# EAGLE schematic RespeakerCorev1.0_SCH (EAGLE 7.3.0)
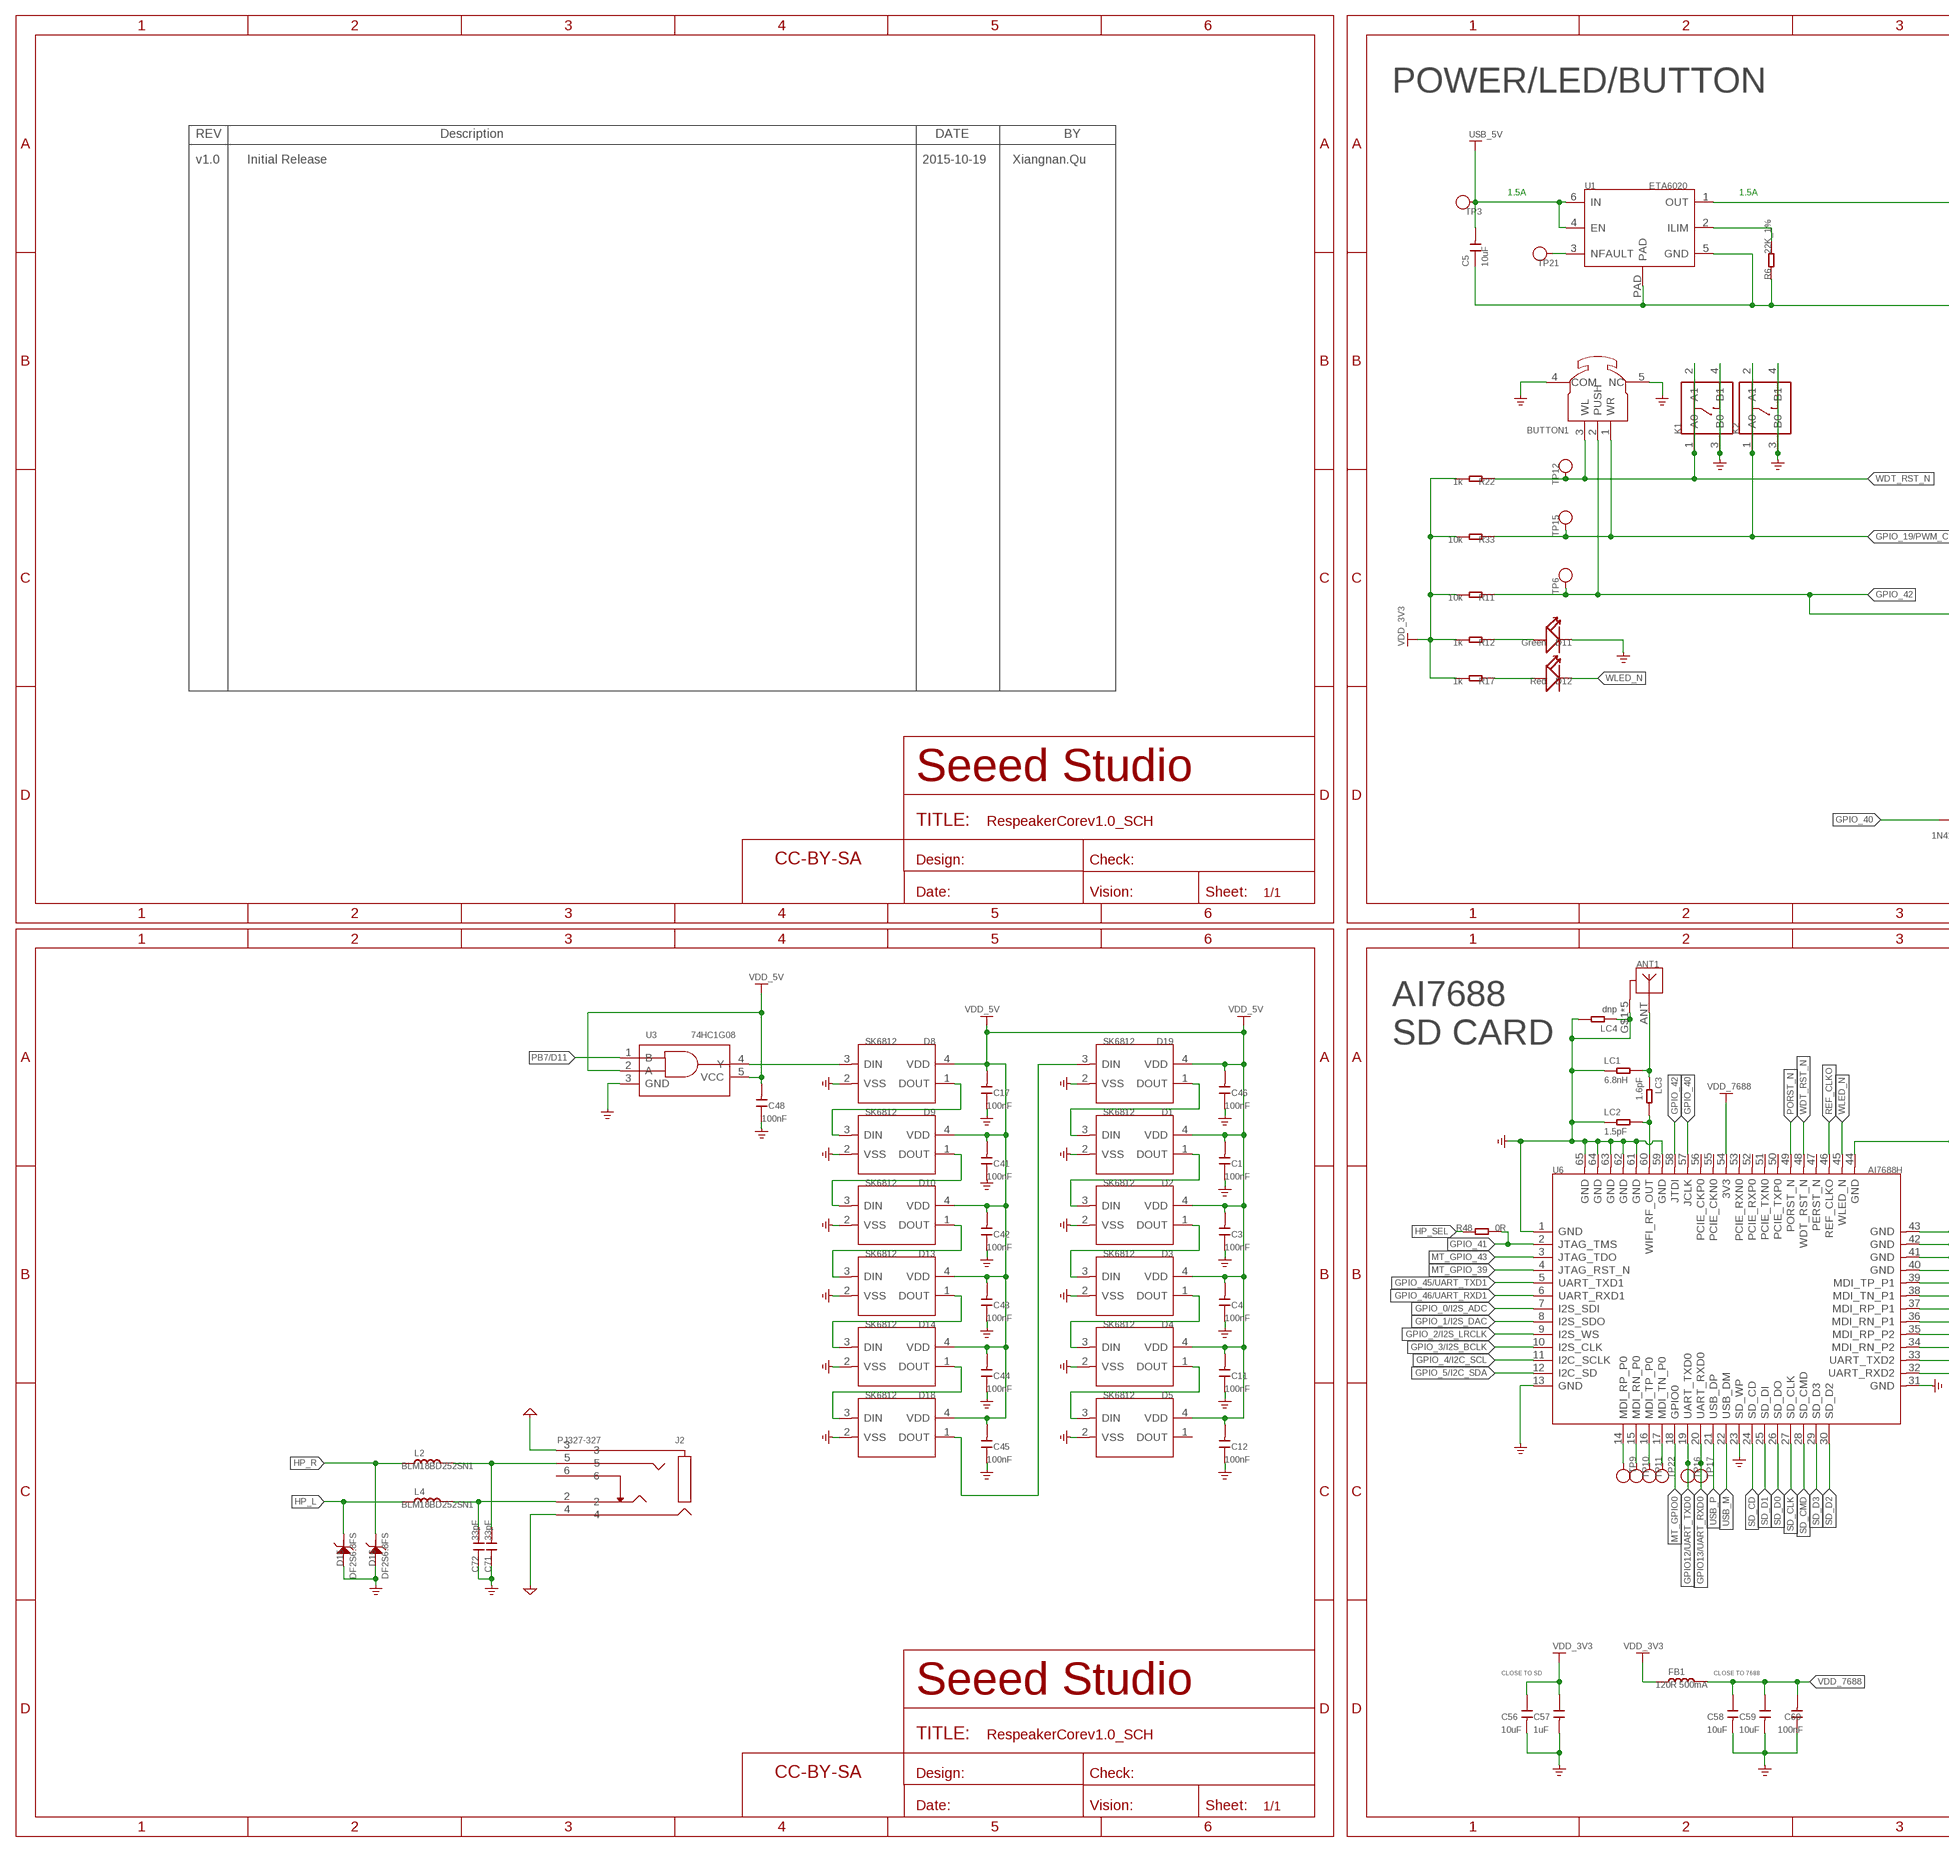
[diagram p0: schematic, sheet 1, part 1 of 2]
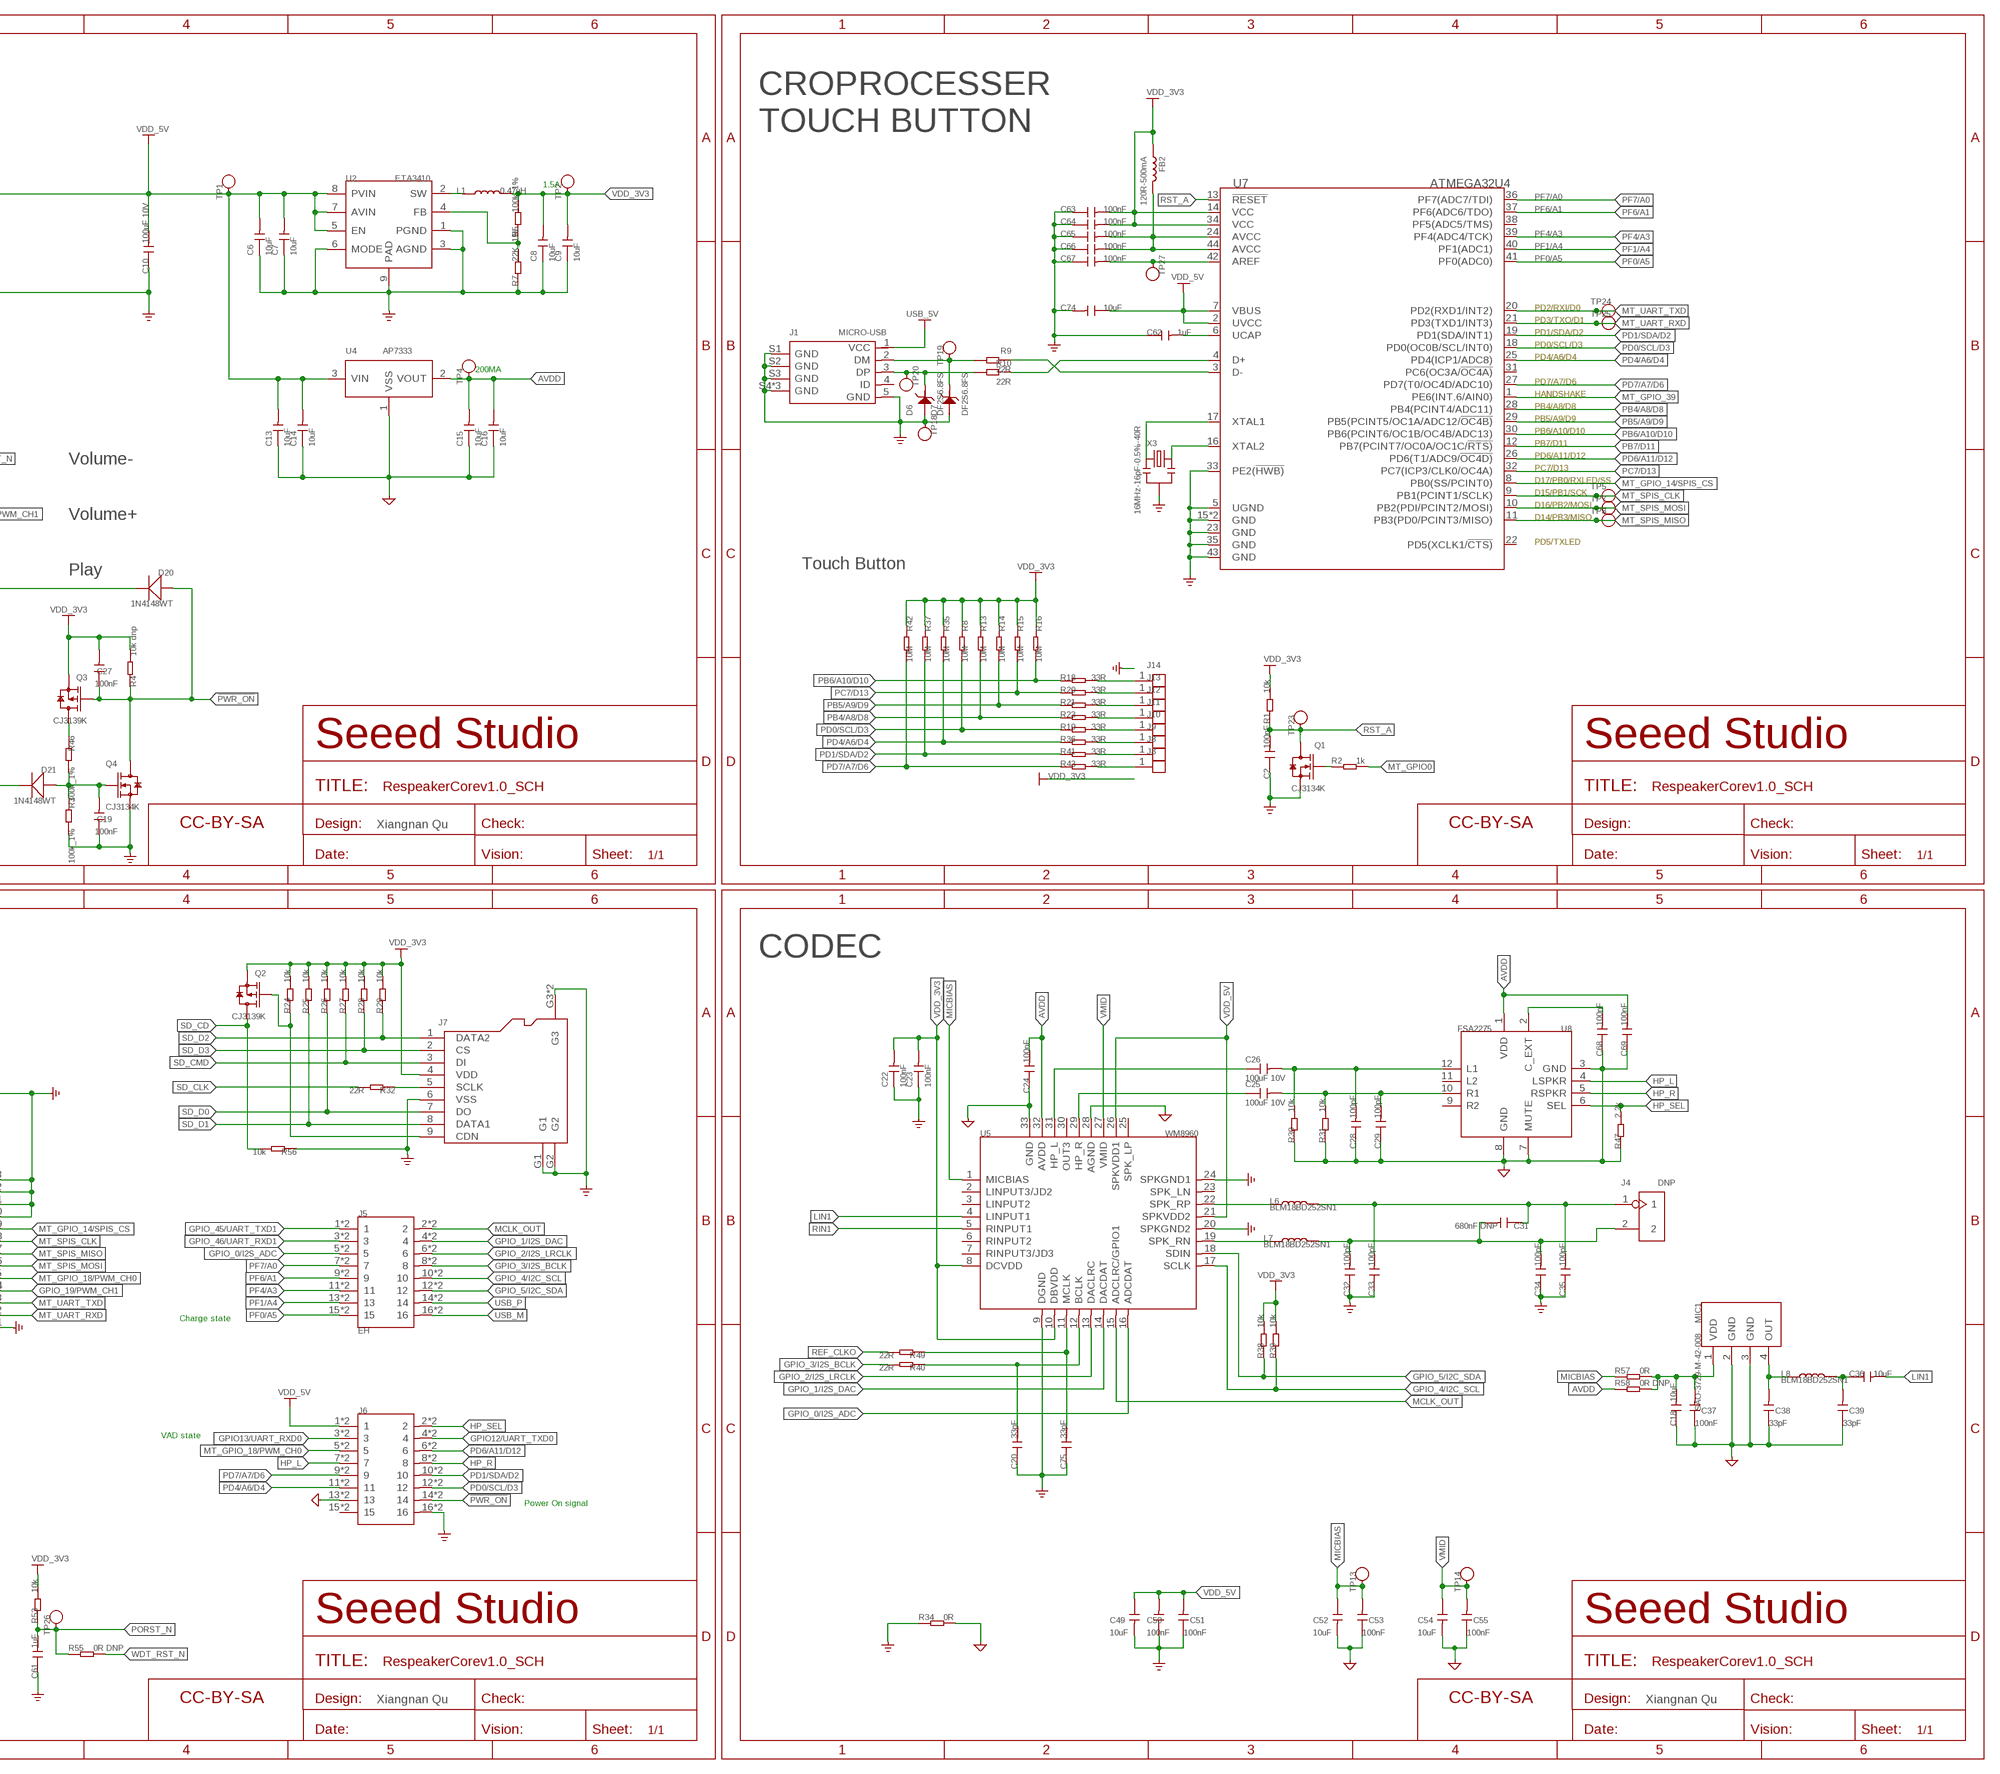
[diagram p1: schematic, sheet 1, part 2 of 2]

## Parts
ANT1  ANTENNA-ACA2012-BOTTOM  [ANT2P-SMD-3.5X1.4MM-BOTTOM]
BUTTON1  BUTTON3+2P  [BUTTON3+2P-SMD-11.8X11.8X2.5MM]
C1  100nF  CAP-0402  [C0402]
C2  100nF  CAP-0402  [C0402]
C3  100nF  CAP-0402  [C0402]
C4  100nF  CAP-0402  [C0402]
C5  10uF  CAP-0603  [C0603]
C6  10uF  CAP-0603  [C0603]
C7  10uF  CAP-0603  [C0603]
C8  10uF  CAP-0603  [C0603]
C9  10uF  CAP-0603  [C0603]
C10  100uF 10V  CAP-1206  [C1206]
C11  100nF  CAP-0402  [C0402]
C12  100nF  CAP-0402  [C0402]
C13  10uF  CAP-0603  [C0603]
C14  10uF  CAP-0603  [C0603]
C15  10uF  CAP-0603  [C0603]
C16  10uF  CAP-0603  [C0603]
C17  100nF  CAP-0402  [C0402]
C18  10uF  CAP-0603  [C0603]
C19  100nF  CAP-0402  [C0402]
C20  33pF  CAP-0402  [C0402]
C22  100nF  CAP-0402  [C0402]
C23  100nF  CAP-0402  [C0402]
C24  100nF  CAP-0402  [C0402]
C25  100uF 10V  CAP-1206  [C1206]
C26  100uF 10V  CAP-1206  [C1206]
C27  100nF  CAP-0402  [C0402]
C28  100pF  CAP-0402  [C0402]
C29  100pF  CAP-0402  [C0402]
C31  680nF DNP  CAP-0402  [C0402]
C32  100pF  CAP-0402  [C0402]
C33  100pF  CAP-0402  [C0402]
C34  100pF  CAP-0402  [C0402]
C35  100pF  CAP-0402  [C0402]
C36  10uF  CAP-0603  [C0603]
C37  100nF  CAP-0402  [C0402]
C38  33pF  CAP-0402  [C0402]
C39  33pF  CAP-0402  [C0402]
C41  100nF  CAP-0402  [C0402]
C42  100nF  CAP-0402  [C0402]
C43  100nF  CAP-0402  [C0402]
C44  100nF  CAP-0402  [C0402]
C45  100nF  CAP-0402  [C0402]
C46  100nF  CAP-0402  [C0402]
C48  100nF  CAP-0402  [C0402]
C49  10uF  CAP-0603  [C0603]
C50  100nF  CAP-0402  [C0402]
C51  100nF  CAP-0402  [C0402]
C52  10uF  CAP-0603  [C0603]
C53  100nF  CAP-0402  [C0402]
C54  10uF  CAP-0603  [C0603]
C55  100nF  CAP-0402  [C0402]
C56  10uF  CAP-0603  [C0603]
C57  1uF  CAP-0402  [C0402]
C58  10uF  CAP-0603  [C0603]
C59  10uF  CAP-0603  [C0603]
C60  100nF  CAP-0402  [C0402]
C61  1uF  CAP-0402  [C0402]
C62  1uF  CAP-0402  [C0402]
C63  100nF  CAP-0402  [C0402]
C64  100nF  CAP-0402  [C0402]
C65  100nF  CAP-0402  [C0402]
C66  100nF  CAP-0402  [C0402]
C67  100nF  CAP-0402  [C0402]
C68  100nF  CAP-0402  [C0402]
C69  100nF  CAP-0402  [C0402]
C71  33pF  CAP-0402  [C0402]
C72  33pF  CAP-0402  [C0402]
C74  10uF  CAP-0603  [C0603]
C75  33pF  CAP-0402  [C0402]
D1  SK6812  LED-RGB-4P-SK68122  [LED4-SMD-3.5X3.7MM]
D2  SK6812  LED-RGB-4P-SK68122  [LED4-SMD-3.5X3.7MM]
D3  SK6812  LED-RGB-4P-SK68122  [LED4-SMD-3.5X3.7MM]
D4  SK6812  LED-RGB-4P-SK68122  [LED4-SMD-3.5X3.7MM]
D5  SK6812  LED-RGB-4P-SK68122  [LED4-SMD-3.5X3.7MM]
D6  DF2S6.8FS  D-ESD-2P'DF2S6.8FS'  [SOD-923]
D7  DF2S6.8FS  D-ESD-2P'DF2S6.8FS'  [SOD-923]
D8  SK6812  LED-RGB-4P-SK68122  [LED4-SMD-3.5X3.7MM]
D9  SK6812  LED-RGB-4P-SK68122  [LED4-SMD-3.5X3.7MM]
D10  SK6812  LED-RGB-4P-SK68122  [LED4-SMD-3.5X3.7MM]
D11  Green  LED'RIGHT'  [LED-SIDE-VIEW-0603-RIGHT]
D12  Red  LED'RIGHT'  [LED-SIDE-VIEW-0603-RIGHT]
D13  SK6812  LED-RGB-4P-SK68122  [LED4-SMD-3.5X3.7MM]
D14  SK6812  LED-RGB-4P-SK68122  [LED4-SMD-3.5X3.7MM]
D15  DF2S6.8FS  D-ESD-2P'DF2S6.8FS'  [SOD-923]
D16  DF2S6.8FS  D-ESD-2P'DF2S6.8FS'  [SOD-923]
D18  SK6812  LED-RGB-4P-SK68122  [LED4-SMD-3.5X3.7MM]
D19  SK6812  LED-RGB-4P-SK68122  [LED4-SMD-3.5X3.7MM]
D20  1N4148WT  DIODE'0603'  [SOD-523]
D21  1N4148WT  DIODE'0603'  [SOD-523]
FB1  120R 500mA  INDUCTOR/FERRITE-BEAD'0603'  [L0603]
FB2  120R-500mA  INDUCTOR/FERRITE-BEAD'0603'  [L0603]
FR1  SEEEDSTUDIO-OPEN-SCH-FRAME  [SEEEDSTUDIO-PCB-FRAME]
FR2  SEEEDSTUDIO-OPEN-SCH-FRAME  [SEEEDSTUDIO-PCB-FRAME]
FR3  SEEEDSTUDIO-OPEN-SCH-FRAME  [SEEEDSTUDIO-PCB-FRAME]
FR4  SEEEDSTUDIO-OPEN-SCH-FRAME  [SEEEDSTUDIO-PCB-FRAME]
FR5  SEEEDSTUDIO-OPEN-SCH-FRAME  [SEEEDSTUDIO-PCB-FRAME]
FR7  SEEEDSTUDIO-OPEN-SCH-FRAME  [SEEEDSTUDIO-PCB-FRAME]
J1  MICRO-USB  MICRO-USB5+4P'5+4P'  [MICRO-USB5+4P-SMD-0.65-B]
J2  PJ327-327  AUDIO-JACK-5P-PJ327-327  [AUDIO5P-14X5X4.4MM]
J3  HEADER-1P-3MM  [1P-DIP-6X4MM]
J4  DNP  HEADER-2P-65/35MIL  [H2-2.54]
J5  EH  HEADER-2X8P-SMD_DRILL-2.0  [H2X8-SMD_DRILL-2.0]
J6  HEADER-2X8P-SMD_DRILL-2.0  [H2X8-SMD_DRILL-2.0]
J7  MICRO-SD-CARD-HOLDER-9P'MICROSD-9P'  [MICRO-SD9+4P-SMD-16.1X14.5X1.85MM]
J8  HEADER-1P-3MM  [1P-DIP-6X4MM]
J9  HEADER-1P-3MM  [1P-DIP-6X4MM]
J10  HEADER-1P-3MM  [1P-DIP-6X4MM]
J11  HEADER-1P-3MM  [1P-DIP-6X4MM]
J12  HEADER-1P-3MM  [1P-DIP-6X4MM]
J13  HEADER-1P-3MM  [1P-DIP-6X4MM]
J14  HEADER-1P-3MM  [1P-DIP-6X4MM]
K1  BUTTON-4P-4.5X3.2  [SW4P-SMD-4.5X3.2X2.5MM]
K2  BUTTON-4P-4.5X3.2  [SW4P-SMD-4.5X3.2X2.5MM]
L1  0.47uH  L-MPM201610SR33_T  [L201610]
L2  BLM18BD252SN1  INDUCTOR/FERRITE-BEAD'0603'  [L0603]
L4  BLM18BD252SN1  INDUCTOR/FERRITE-BEAD'0603'  [L0603]
L6  BLM18BD252SN1  INDUCTOR/FERRITE-BEAD'0603'  [L0603]
L7  BLM18BD252SN1  INDUCTOR/FERRITE-BEAD'0603'  [L0603]
L8  BLM18BD252SN1  INDUCTOR/FERRITE-BEAD'0603'  [L0603]
LC1  6.8nH  RES-0402  [R0402]
LC2  1.5pF  RES-0402  [R0402]
LC3  1.6pF  RES-0402  [R0402]
LC4  dnp  RES-0402  [R0402]
MIC1  SAO-3729-M-42-008  MIC-MSM421A3729H8-C  [MIC4-SMD-3.76X2.95MM]
Q1  CJ3134K  MOSFET-N-CJ3134K  [SOT-723]
Q2  CJ3139K  MOSFET-P-CJ3139K  [SOT-723]
Q3  CJ3139K  MOSFET-P-CJ3139K  [SOT-723]
Q4  CJ3134K  MOSFET-N-CJ3134K  [SOT-723]
R1  10k  RES-0402  [R0402]
R2  1k  RES-0402  [R0402]
R3  100k_1%  RES-0402  [R0402]
R4  10k dnp  RES-0402  [R0402]
R5  100k_1%  RES-0402  [R0402]
R6  22K_1%  RES-0402  [R0402]
R7  22K_1%  RES-0402  [R0402]
R8  10M  RES-0402  [R0402]
R9  22R  RES-0402  [R0402]
R10  22R  RES-0402  [R0402]
R11  10k  RES-0402  [R0402]
R12  1k  RES-0402  [R0402]
R13  10M  RES-0402  [R0402]
R14  10M  RES-0402  [R0402]
R15  10M  RES-0402  [R0402]
R16  10M  RES-0402  [R0402]
R17  1k  RES-0402  [R0402]
R18  33R  RES-0402  [R0402]
R19  33R  RES-0402  [R0402]
R20  33R  RES-0402  [R0402]
R21  33R  RES-0402  [R0402]
R22  1k  RES-0402  [R0402]
R23  33R  RES-0402  [R0402]
R24  10k  RES-0402  [R0402]
R25  10k  RES-0402  [R0402]
R26  10k  RES-0402  [R0402]
R27  10k  RES-0402  [R0402]
R28  10k  RES-0402  [R0402]
R29  10k  RES-0402  [R0402]
R30  10k  RES-0402  [R0402]
R31  10k  RES-0402  [R0402]
R32  22R  RES-0402  [R0402]
R33  10k  RES-0402  [R0402]
R34  0R  RES-0402  [R0402]
R35  10M  RES-0402  [R0402]
R36  33R  RES-0402  [R0402]
R37  10M  RES-0402  [R0402]
R38  10k  RES-0402  [R0402]
R39  10k  RES-0402  [R0402]
R40  22R  RES-0402  [R0402]
R41  33R  RES-0402  [R0402]
R42  10M  RES-0402  [R0402]
R43  33R  RES-0402  [R0402]
R46  100k_1%  RES-0402  [R0402]
R47  2.2k  RES-0402  [R0402]
R48  0R  RES-0402  [R0402]
R49  22R  RES-0402  [R0402]
R53  10k  RES-0402  [R0402]
R55  0R DNP  RES-0402  [R0402]
R56  10k  RES-0402  [R0402]
R57  0R  RES-0402  [R0402]
R58  0R DNP  RES-0402  [R0402]
TP1  TEST-POINT'4545'  [TP-D45MIL]
TP2  TEST-POINT'4545'  [TP-D45MIL]
TP3  TEST-POINT'4545'  [TP-D45MIL]
TP4  TEST-POINT'4545'  [TP-D45MIL]
TP5  TEST-POINT'4545'  [TP-D45MIL]
TP6  TEST-POINT'4545'  [TP-D45MIL]
TP7  TEST-POINT'4545'  [TP-D45MIL]
TP8  TEST-POINT'4545'  [TP-D45MIL]
TP9  TEST-POINT'4080'  [TP-80X40MIL]
TP10  TEST-POINT'4080'  [TP-80X40MIL]
TP11  TEST-POINT'4080'  [TP-80X40MIL]
TP12  TEST-POINT'4545'  [TP-D45MIL]
TP13  TEST-POINT'4545'  [TP-D45MIL]
TP14  TEST-POINT'4545'  [TP-D45MIL]
TP15  TEST-POINT'4545'  [TP-D45MIL]
TP16  TEST-POINT'4545'  [TP-D45MIL]
TP17  TEST-POINT'4545'  [TP-D45MIL]
TP18  TEST-POINT'4545'  [TP-D45MIL]
TP19  TEST-POINT'4545'  [TP-D45MIL]
TP20  TEST-POINT'4545'  [TP-D45MIL]
TP21  TEST-POINT'4545'  [TP-D45MIL]
TP22  TEST-POINT'4080'  [TP-80X40MIL]
TP23  TEST-POINT'4545'  [TP-D45MIL]
TP24  TEST-POINT'4545'  [TP-D45MIL]
TP25  TEST-POINT'4545'  [TP-D45MIL]
TP26  TEST-POINT'4545'  [TP-D45MIL]
TP27  TEST-POINT'4545'  [TP-D45MIL]
U1  ETA6020  PMIC-ETA6020D2G-T_UDFN6  [DFN6G-0.65-2X2MM]
U2  ETA3410  CONVERTER-ETA3410  [DFN8G-0.5-2X2MM]
U3  74HC1G08  LOGIC-74HC1G08'GW'  [SOT-353]
U4  AP7333  PMIC-XC6206PMR  [SOT-23]
U5  WM8960  AMPLIFIER-WM8960  [QFN32G-0.5-5X5MM]
U6  AI7688H  MOUDLE-IOT-AI7688H  [LGA65-1.7-24X32X1.8MM]
U7  ATMEGA32U4  MCU-ATMEGA32U4-MUR  [VQFN-44]
U8  FSA2275  SWITCH-ANALOG-FSA2275  [LEAD12P-SMD-0.4-1.8X1.8X0.5MM]
X3  16MHz-16pF-0.5%-40R  CRYSTAL-RESONATOR'SMD'  [RESONATOR3-SMD-3.6X1.3X0.8MM]

## Nets
!PWR_ON: C27.1 D20.+ J6.14 J6.P$14 Q3.1(G) Q4.3(D) R4.1
AGND: C13.1 C14.1 C15.1 C16.1 C18.1 C24.1 C28.1 C29.1 C37.1 C38.1 C39.1 C52.2 C53.1 C54.2 C55.1 C68.1 C69.1 J2.3 J2.4 J6.13 J6.P$13 MIC1.2(GND) MIC1.3(GND) R30.1 R31.1 R34.2 R47.1 U4.1(VSS) U5.28(AGND) U5.33(GND) U8.3(GND) U8.7(MUTE) U8.8(GND) ; supply symbol labelled GND_SIGNAL
AVDD: C15.2 C16.2 C24.2 C69.2 R58.1 TP4.T U4.2(VOUT) U5.32(AVDD) U8.1(VDD)
GND: ANT1.G$1 ANT1.G$2 ANT1.G$4 ANT1.GND1 ANT1.GND2 BUTTON1.4(COM) BUTTON1.5(NC) C1.1 C2.1 C3.1 C4.1 C5.1 C6.1 C7.1 C8.1 C9.1 C10.1 C11.1 C12.1 C17.1 C19.1 C20.1 C22.1 C23.1 C32.1 C33.1 C34.1 C35.1 C41.1 C42.1 C43.1 C44.1 C45.1 C46.1 C48.1 C49.2 C50.1 C51.1 C56.2 C57.2 C58.2 C59.2 C60.1 C61.1 C62.1 C63.1 C64.1 C65.1 C66.1 C67.1 C71.1 C72.1 C74.2 C75.1 D1.2(VSS) D2.2(VSS) D3.2(VSS) D4.2(VSS) D5.2(VSS) D6.2 D7.2 D8.2(VSS) D9.2(VSS) D10.2(VSS) D11.2(-) D13.2(VSS) D14.2(VSS) D15.2 D16.2 D18.2(VSS) D19.2(VSS) J1.5(GND) J1.S1(GND) J1.S2(GND) J1.S3(GND) J1.S4(GND) J1.S5(GND) J1.S6(GND) J6.16 J6.P$16 J7.6(VSS) J7.G1 J7.G2 J7.G3 J7.G4(G3) K1.3(B0) K1.4(B1) K2.3(B0) K2.4(B1) LC1.1 LC2.1 LC4.1 LC4.2 Q1.2(S) Q4.2(S) R3.2 R6.1 R7.1 R34.1 R56.1 TP18.T U1.5(GND) U1.PAD U2.1(PGND) U2.3(AGND) U2.6(MODE) U2.9(PAD) U3.3(GND) U5.9(DGND) U5.20(SPKGND2) U5.24(SPKGND1) U6.1(GND) U6.13(GND) U6.23(SD_WP) U6.31(GND) U6.40(GND) U6.41(GND) U6.42(GND) U6.43(GND) U6.44(GND) U6.59(GND) U6.61(GND) U6.62(GND) U6.63(GND) U6.64(GND) U6.65(GND) U7.5(UGND) U7.15(GND) U7.23(GND) U7.33(PE2(!HWB)) U7.35(GND) U7.43(GND) U7.TAB(GND) X3.2 ; supply symbol labelled GND_POWER
GPIO12/UART_TXD0: J6.4 J6.P$4 TP16.T U6.19(UART_TXD0)
GPIO13/UART_RXD0: J6.3 J6.P$3 TP17.T U6.20(UART_RXD0)
GPIO_0/I2S_ADC: J5.5 J5.P$5 U5.16(ADCDAT) U6.7(I2S_SDI)
GPIO_1/I2S_DAC: J5.4 J5.P$4 U5.14(DACDAT) U6.8(I2S_SDO)
GPIO_2/I2S_LRCLK: J5.6 J5.P$6 U5.13(DACLRC) U6.9(I2S_WS)
GPIO_3/I2S_BCLK: J5.8 J5.P$8 R40.2 U6.10(I2S_CLK)
GPIO_4/I2C_SCL: J5.10 J5.P$10 R39.1 U5.17(SCLK) U6.11(I2C_SCLK)
GPIO_5/I2C_SDA: J5.12 J5.P$12 R38.1 U5.18(SDIN) U6.12(I2C_SD)
GPIO_19/PWM_CH1: BUTTON1.1(WR) K2.1(A0) K2.2(A1) R33.1 TP15.T U6.34(MDI_RN_P2)
GPIO_40: D21.- U6.57(JCLK)
GPIO_41: R48.1 U6.2(JTAG_TMS)
GPIO_42: BUTTON1.2(PUSH) D20.- R11.1 TP6.T U6.58(JTDI)
GPIO_45/UART_TXD1: J5.1 J5.P$1 U6.5(UART_TXD1)
GPIO_46/UART_RXD1: J5.3 J5.P$3 U6.6(UART_RXD1)
HP_L: D15.1 J6.7 J6.P$7 L4.1 U8.4(LSPKR)
HP_R: D16.1 J6.8 J6.P$8 L2.1 U8.5(RSPKR)
HP_SEL: J6.2 J6.P$2 R47.2 R48.2 U8.6(SEL)
LIN1: C36.2 U5.4(LINPUT1)
MCLK_OUT: J5.2 J5.P$2 U5.15(ADCLRC/GPIO1)
MIC_VDD: C18.2 C37.2 MIC1.1(VDD) R57.2 R58.2
MICBIAS: C52.1 C53.2 R57.1 TP13.T U5.1(MICBIAS)
MT_GPIO0: R2.2 U6.18(GPIO0)
MT_GPIO_14/SPIS_CS: U6.39(MDI_TP_P1) U7.8(PB0(SS/PCINT0))
MT_GPIO_18/PWM_CH0: J6.5 J6.P$5 U6.35(MDI_RP_P2)
MT_GPIO_39: U6.4(JTAG_RST_N) U7.1(PE6(INT.6/AIN0))
MT_GPIO_43: U6.3(JTAG_TDO)
MT_SPIS_CLK: TP5.T U6.38(MDI_TN_P1) U7.9(PB1(PCINT1/SCLK))
MT_SPIS_MISO: TP8.T U6.37(MDI_RP_P1) U7.11(PB3(PD0/PCINT3/MISO))
MT_SPIS_MOSI: TP7.T U6.36(MDI_RN_P1) U7.10(PB2(PDI/PCINT2/MOSI))
MT_UART_RXD: TP25.T U6.32(UART_RXD2) U7.21(PD3(TXD1/INT3))
MT_UART_TXD: TP24.T U6.33(UART_TXD2) U7.20(PD2(RXD1/INT2))
N$1: Q3.3(D) R46.1
N$2: LC2.2 LC3.2 U6.60(WIFI_RF_OUT)
N$3: D11.1(+) R12.1
N$4: C68.2 U8.2(C_EXT)
N$5: C75.2 R49.1 U5.11(MCLK)
N$6: C38.2 L8.1 MIC1.4(OUT)
N$7: D12.1(+) R17.1
N$8: R10.1 U7.4(D+)
N$9: J7.5(SCLK) R32.1
N$10: R9.1 U7.3(D-)
N$11: D9.1(DOUT) D10.3(DIN)
N$12: R6.2 U1.2(ILIM)
N$13: D1.3(DIN) D19.1(DOUT)
N$14: L6.1 U5.22(SPK_RP)
N$15: D7.1 J1.2(DM) R9.2 TP19.T
N$16: D6.1 J1.3(DP) R10.2 TP20.T
N$18: D10.1(DOUT) D13.3(DIN)
N$19: D8.1(DOUT) D9.3(DIN)
N$20: J13.1 R20.2
N$21: C19.2 D21.+ Q4.1(G) R3.1 R46.2
N$22: J14.1 R18.2
N$23: D13.1(DOUT) D14.3(DIN)
N$24: C36.1 C39.2 L8.2
N$25: D14.1(DOUT) D18.3(DIN)
N$26: C20.2 R40.1 U5.12(BCLK)
N$27: TP9.1(T) U6.14(MDI_RP_P0)
N$28: Q1.1(G) R2.1
N$29: L1.1 U2.2(SW)
N$30: D18.1(DOUT) D19.3(DIN)
N$31: J8.1 R41.2
N$32: R5.1 R7.2 U2.4(FB)
N$33: J12.1 R21.2
N$34: J11.1 R23.2
N$35: J3.1 R43.2
N$36: J9.1 R36.2
N$37: J10.1 R19.2
N$38: L7.1 U5.19(SPK_RN)
N$39: C31.1 C33.2 C35.2 J4.1 L6.2
N$40: C62.2 U7.6(UCAP)
N$41: C67.2 TP27.T U7.42(AREF)
N$42: D1.1(DOUT) D2.3(DIN)
N$43 [none3]: C65.2 C66.2 FB2.2 U7.24(AVCC) U7.44(AVCC)
N$44: D2.1(DOUT) D3.3(DIN)
N$45: D3.1(DOUT) D4.3(DIN)
N$46: D4.1(DOUT) D5.3(DIN)
N$47: C31.2 C32.2 C34.2 J4.2 L7.2
N$49: U7.17(XTAL1) X3.1
N$50: U7.16(XTAL2) X3.3
N$51: ANT1.ANT LC1.2 LC3.1
N$52: TP10.1(T) U6.15(MDI_RN_P0)
N$53: TP11.1(T) U6.16(MDI_TP_P0)
N$54: TP22.1(T) U6.17(MDI_TN_P0)
N$57: C26.2 C28.2 R30.2 U8.12(L1)
N$58: C25.1 U5.29(HP_R)
N$59: D8.3(DIN) U3.4(Y)
N$60: C26.1 U5.31(HP_L)
N$61: C25.2 C29.2 R31.2 U8.10(R1)
N$63: C72.2 J2.2 L4.2
N$64: C71.2 J2.5 L2.2
PB4/A8/D8: R13.1 R23.1 U7.28(PB4(PCINT4/ADC11))
PB5/A9/D9: R14.1 R21.1 U7.29(PB5(PCINT5/OC1A/ADC12/!OC4B))
PB6/A10/D10: R16.1 R18.1 U7.30(PB6(PCINT6/OC1B/OC4B/ADC13))
PB7/D11: U3.1(B) U7.12(PB7(PCINT7/OC0A/OC1C/!RTS))
PC7/D13: R15.1 R20.1 U7.32(PC7(ICP3/CLK0/OC4A))
PD0/SCL/D3: J6.12 J6.P$12 R8.1 R19.1 U7.18(PD0(OC0B/SCL/INT0))
PD1/SDA/D2: J6.10 J6.P$10 R37.1 R41.1 U7.19(PD1(SDA/INT1))
PD4/A6/D4: J6.11 J6.P$11 R35.1 R36.1 U7.25(PD4(ICP1/ADC8))
PD6/A11/D12: J6.6 J6.P$6 U7.26(PD6(T1/ADC9/!OC4D))
PD7/A7/D6: J6.9 J6.P$9 R42.1 R43.1 U7.27(PD7(T0/OC4D/ADC10))
PF0/A5: J5.15 J5.P$15 U7.41(PF0(ADC0))
PF1/A4: J5.13 J5.P$13 U7.40(PF1(ADC1))
PF4/A3: J5.11 J5.P$11 U7.39(PF4(ADC4/TCK))
PF6/A1: J5.9 J5.P$9 U7.37(PF6(ADC6/TDO))
PF7/A0: J5.7 J5.P$7 U7.36(PF7(ADC7/TDI))
PORST_N: C61.2 R53.1 R55.1 TP26.T U6.49(PORST_N)
PW_FAULT: TP21.T U1.3(NFAULT)
REF_CLKO: R49.2 U6.46(REF_CLKO)
RIN1: U5.5(RINPUT1)
RST_A: C2.2 Q1.3(D) R1.1 TP23.T U7.13(!RESET)
SD_CD: Q2.3(D) R56.2 U6.24(SD_CD)
SD_CLK: R32.2 U6.27(SD_CLK)
SD_CMD: J7.3(DI) R27.1 U6.28(SD_CMD)
SD_D0: J7.7(DO) R26.1 U6.26(SD_DO)
SD_D1: J7.8(DATA1) R25.1 U6.25(SD_DI)
SD_D2: J7.1(DATA2) R29.1 U6.30(SD_D2)
SD_D3: J7.2(CS) R28.1 U6.29(SD_D3)
SSSS: J7.9(CDN) Q2.1(G) R24.1
USB_5V: C5.2 J1.1(VCC) TP3.T U1.4(EN) U1.6(IN) ; supply symbol labelled POWER_BAR
USB_M: J5.16 J5.P$16 U6.22(USB_DM)
USB_P: J5.14 J5.P$14 U6.21(USB_DP)
VDD_3V3: C8.2 C9.2 C22.2 C23.2 C27.2 C56.1 C57.1 C63.2 C64.2 FB1.1 FB2.1 J7.4(VDD) L1.2 Q2.2(S) Q3.2(S) R1.2 R4.2 R5.2 R8.2 R11.2 R12.2 R13.2 R14.2 R15.2 R16.2 R17.2 R22.2 R24.2 R25.2 R26.2 R27.2 R28.2 R29.2 R33.2 R35.2 R37.2 R38.2 R39.2 R42.2 R53.2 TP2.T U5.8(DCVDD) U5.10(DBVDD) U7.14(VCC) U7.34(VCC) ; supply symbol labelled POWER_BAR
VDD_5V: C1.2 C3.2 C4.2 C6.2 C7.2 C10.2 C11.2 C12.2 C13.2 C14.2 C17.2 C41.2 C42.2 C43.2 C44.2 C45.2 C46.2 C48.2 C49.1 C50.2 C51.2 C74.1 D1.4(VDD) D2.4(VDD) D3.4(VDD) D4.4(VDD) D5.4(VDD) D8.4(VDD) D9.4(VDD) D10.4(VDD) D13.4(VDD) D14.4(VDD) D18.4(VDD) D19.4(VDD) J6.1 J6.P$1 TP1.T U1.1(OUT) U2.5(EN) U2.7(AVIN) U2.8(PVIN) U3.2(A) U3.5(VCC) U4.3(VIN) U5.21(SPKVDD2) U5.26(SPKVDD1) U7.2(UVCC) U7.7(VBUS) ; supply symbol labelled POWER_BAR
VDD_7688: C58.1 C59.1 C60.2 FB1.2 U6.54(3V3) ; supply symbol labelled POWER_BAR
VMID: C54.1 C55.2 TP14.T U5.27(VMID)
WDT_RST_N: BUTTON1.3(WL) K1.1(A0) K1.2(A1) R22.1 R55.2 TP12.T U6.48(WDT_RST_N)
WLED_N: D12.2(-) U6.45(WLED_N)
Unconnected: D5.1(DOUT) J1.4(ID) J2.6 J6.15 J6.P$15 U5.2(LINPUT3/JD2) U5.3(LINPUT2) U5.6(RINPUT2) U5.7(RINPUT3/JD3) U5.23(SPK_LN) U5.25(SPK_LP) U5.30(OUT3) U6.47(PERST_N) U6.50(PCIE_TXP0) U6.51(PCIE_TXN0) U6.52(PCIE_RXP0) U6.53(PCIE_RXN0) U6.55(PCIE_CKN0) U6.56(PCIE_CKP0) U7.22(PD5(XCLK1/!CTS)) U7.31(PC6(OC3A/!OC4A)) U7.38(PF5(ADC5/TMS)) U8.9(R2) U8.11(L2)

## Notes on the sheet
- POWER/LED/BUTTON
- CROPROCESSER
  TOUCH BUTTON
- v1.0 | Initial Release | 2015-10-19 | Xiangnan.Qu
- 1.5A | 1.5A | 1.5A
- PD2/RXI/D0
- PD3/TXO/D1
- PD1/SDA/D2
- PD0/SCL/D3
- PD4/A6/D4
- 200MA
- PD7/A7/D6
- HANDSHAKE
- PB4/A8/D8
- PB5/A9/D9
- PB6/A10/D10
- PB7/D11
- PD6/A11/D12
- Volume-
- PC7/D13
- D17/PB0/RXLED/SS
- D15/PB1/SCK
- D16/PB2/MOSI
- Volume+ | D14/PB3/MISO
- PD5/TXLED
- Touch Button
- Play
- Xiangnan Qu
- CODEC
- AI7688
  SD CARD
- Charge state
- VAD state
- Power On signal
- CLOSE TO SD | CLOSE TO 7688
- Xiangnan Qu | Xiangnan Qu

## Library data of the parts
ANT1 = Connector-new:ANTENNA-ACA2012
BUTTON1 = template:BUTTON3+2P
C1-C20 C22-C29 C31-C39 C41-C46 C48-C69 C71 C72 C74 C75 = Discrete-new:CAP: Ceramic Capacitors
D1-D5 D8-D10 D13 D14 D18 D19 = Discrete-new:LED-RGB-4P: 304990003
D6 D7 D15 D16 = Discrete-new:D-ESD-2P: SOD-923:304060009;SOD-123:304060001
D11 D12 = Discrete-new:LED
D20 D21 = Discrete-new:DIODE*
FB1 FB2 L2 L4 L6-L8 = Discrete-new:INDUCTOR/FERRITE-BEAD
FR1-FR5 FR7 = moudle-new:SEEEDSTUDIO-OPEN-SCH-FRAME
J1 = Connector-new:MICRO-USB5+4P: 5+4P-SMD-0.65-B:320010000;5+2P-SMD-0.65-AB:340032001
J2 = template:AUDIO-JACK-5P-PJ327
J3 J8-J14 = Connector-new:HEADER-1P
J4 = Connector-new:HEADER-2P
J5 J6 = Connector-new:HEADER-2X8P
J7 = Connector-new:MICRO-SD-CARD-HOLDER-9P: 320090000; SKU: 320090000
K1 K2 = Discrete-new:BUTTON-4P: SW4-6.0X6.0X5.0MM:311020024;SW4-8.0X8.0X9.0MM:311020028;SW4-SMD-6.0X6.0X5.0MM:311020004;SW4-SMD-3.35X3.35X1.5MM:311020030;SW4-SMD-5.2X5.2X2.5MM:311020046
L1 = Discrete-new:L
LC1-LC4 R1-R43 R46-R49 R53 R55-R58 = Discrete-new:RES
MIC1 = Connector-new:MIC-MSM421A3729H8-C
Q1 Q4 = Discrete-new:MOSFET-N
Q2 Q3 = Discrete-new:MOSFET-P
TP1-TP8 TP12-TP21 TP23-TP27 = Discrete-new:TEST-POINT; PARTNO: DNP
TP9-TP11 TP22 = Discrete-new:TEST-POINT
U1 = IC-new:PMIC-ETA6020D2G-T_U: 310990024
U2 = IC-new:CONVERTER-ETA3410: 3MHZ 2A High Step-Down Converter in DFN2x2-8L Package
U3 = IC-new:LOGIC-74HC1G08: 2-input AND gate
U4 = IC-new:PMIC-XC6206P: LOW ESR Cap.Compatible Positive Voltage Regulators
U5 = IC-new:AMPLIFIER-WM8960
U6 = moudle-new:MOUDLE-IOT-AI7688H
U7 = IC-new:MCU-ATMEGA32U4: TQFP-44:310010010;VQFN-44:310010016
U8 = template:SWITCH-ANALOG-FSA2275
X3 = Discrete-new:CRYSTAL-RESONATOR: Resonator Small SMD resonator. This is the itty bitty 10/20MHz resonators with built in caps. CSTCE10M0G55 and CSTCE20M0V53. Footprint has been reviewed closely but hasn't been tested yet.